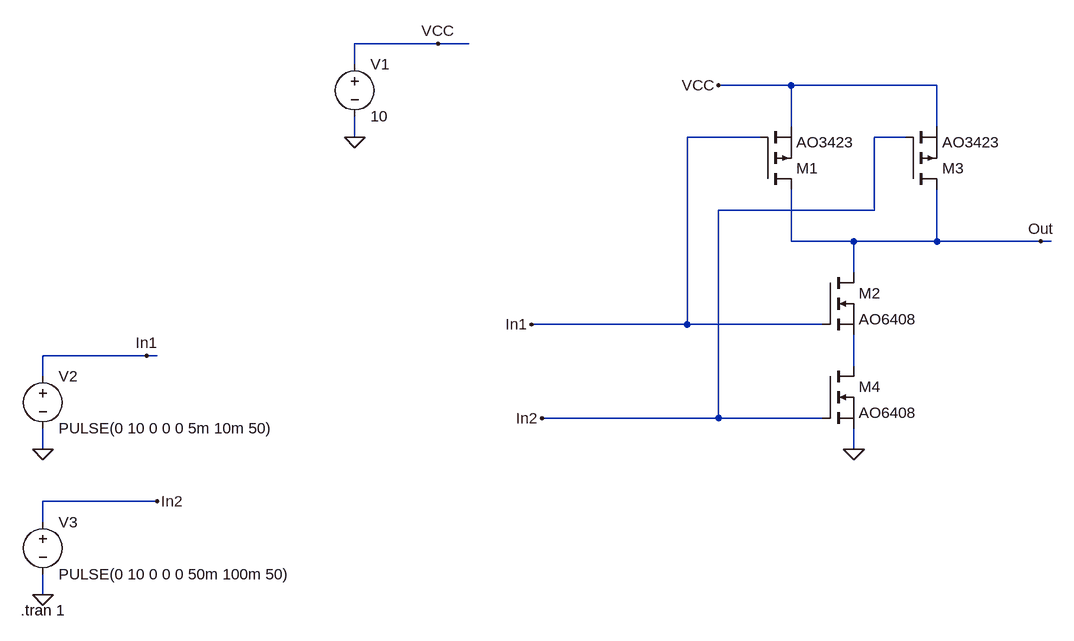
[diagram p0: schematic Draft1.asc]
Draft1.asc, the LTspice schematic file:
Version 4
SHEET 1 880 888
WIRE -288 0 -416 0
WIRE -240 0 -288 0
WIRE -416 32 -416 0
WIRE 256 64 144 64
WIRE 480 64 256 64
WIRE 256 128 256 64
WIRE 480 128 480 64
WIRE -416 144 -416 112
WIRE 208 144 96 144
WIRE 432 144 384 144
WIRE 384 256 384 144
WIRE 384 256 144 256
WIRE 256 304 256 224
WIRE 352 304 256 304
WIRE 480 304 480 224
WIRE 480 304 352 304
WIRE 640 304 480 304
WIRE 656 304 640 304
WIRE 352 352 352 304
WIRE 96 432 96 144
WIRE 96 432 -144 432
WIRE 304 432 96 432
WIRE -736 480 -896 480
WIRE -720 480 -736 480
WIRE 352 496 352 448
WIRE -896 512 -896 480
WIRE 144 576 144 256
WIRE 144 576 -128 576
WIRE 304 576 144 576
WIRE -896 624 -896 592
WIRE 352 624 352 592
WIRE -720 704 -896 704
WIRE -896 736 -896 704
WIRE -896 848 -896 816
FLAG 352 624 0
FLAG 144 64 VCC
FLAG 640 304 Out
FLAG -144 432 In1
FLAG -128 576 In2
FLAG -416 144 0
FLAG -288 0 VCC
FLAG -896 624 0
FLAG -896 848 0
FLAG -736 480 In1
FLAG -720 704 In2
SYMBOL pmos 208 224 M180
SYMATTR InstName M1
SYMATTR Value AO3423
SYMBOL nmos 304 352 R0
SYMATTR InstName M2
SYMATTR Value AO6408
SYMBOL pmos 432 224 M180
SYMATTR InstName M3
SYMATTR Value AO3423
SYMBOL nmos 304 496 R0
SYMATTR InstName M4
SYMATTR Value AO6408
SYMBOL voltage -416 16 R0
WINDOW 123 0 0 Left 0
WINDOW 39 0 0 Left 0
SYMATTR InstName V1
SYMATTR Value 10
SYMBOL voltage -896 496 R0
WINDOW 123 0 0 Left 0
WINDOW 39 0 0 Left 0
SYMATTR InstName V2
SYMATTR Value PULSE(0 10 0 0 0 5m 10m 50)
SYMBOL voltage -896 720 R0
WINDOW 123 0 0 Left 0
WINDOW 39 0 0 Left 0
SYMATTR InstName V3
SYMATTR Value PULSE(0 10 0 0 0 50m 100m 50)
TEXT -930 872 Left 2 !.tran 1

The netlist it stands for:
* Draft1.asc
M1 Out In1 VCC VCC AO3423
M2 Out In1 N001 N001 AO6408
M3 Out In2 VCC VCC AO3423
M4 N001 In2 0 0 AO6408
V1 VCC 0 10
V2 In1 0 PULSE(0 10 0 0 0 5m 10m 50)
V3 In2 0 PULSE(0 10 0 0 0 50m 100m 50)
.model NMOS NMOS
.model PMOS PMOS
.lib standard.mos
.tran 1
.backanno
.end

* Results of the author's LTspice run, read from the files saved beside the schematic
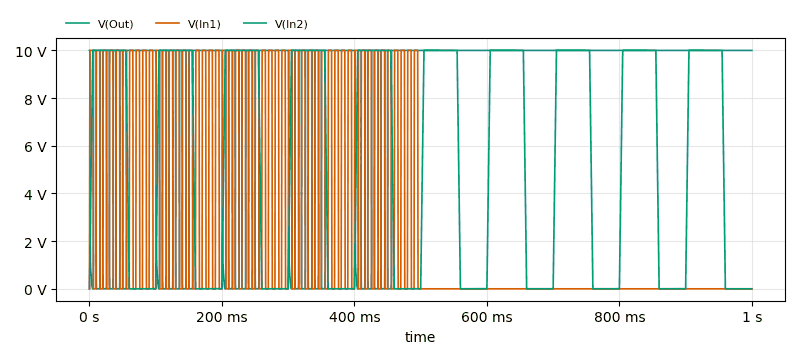
[diagram p1: Transient Analysis of Draft1.asc, plotted from the saved traces]
* Transient Analysis, 1 run:
*   V(Out): min 0 V, max 10 V, average 8.329 V, rms 9.112 V, last 10 V
*   V(In1): min 0 V, max 10 V, average 2.75 V, rms 5.165 V, last 0 V
*   V(In2): min 0 V, max 10 V, average 5.5 V, rms 7.306 V, last 0 V